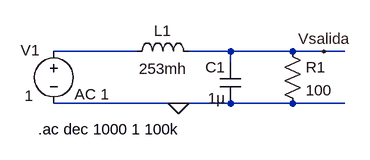
[diagram p0: schematic TP3 DASE pasa bajo.asc]
TP3 DASE pasa bajo.asc, the LTspice schematic file:
Version 4
SHEET 1 880 680
WIRE 128 80 0 80
WIRE 272 80 208 80
WIRE 368 80 272 80
WIRE 416 80 368 80
WIRE 448 80 416 80
WIRE 272 96 272 80
WIRE 192 160 0 160
WIRE 272 160 192 160
WIRE 368 160 272 160
WIRE 448 160 368 160
FLAG 192 160 0
FLAG 416 80 Vsalida
SYMBOL ind 112 96 R270
WINDOW 0 32 56 VTop 2
WINDOW 3 5 56 VBottom 2
SYMATTR InstName L1
SYMATTR Value 253mh
SYMBOL cap 288 160 R180
WINDOW 0 24 56 Left 2
WINDOW 3 24 8 Left 2
SYMATTR InstName C1
SYMATTR Value 1µ
SYMBOL res 352 64 R0
SYMATTR InstName R1
SYMATTR Value 100
SYMBOL voltage 0 64 R0
WINDOW 0 -51 14 Left 2
WINDOW 3 -45 84 Left 2
WINDOW 123 32 82 Left 2
WINDOW 39 0 0 Left 0
SYMATTR InstName V1
SYMATTR Value 1
SYMATTR Value2 AC 1
TEXT -24 200 Left 2 !.ac dec 1000 1 100k

The netlist it stands for:
* TP3 DASE pasa bajo.asc
L1 N001 Vsalida 253mh
C1 0 Vsalida 1µ
R1 Vsalida 0 100
V1 N001 0 1 AC 1
.ac dec 1000 1 100k
.backanno
.end